# EAGLE design untitled (EAGLE 9.6.2)
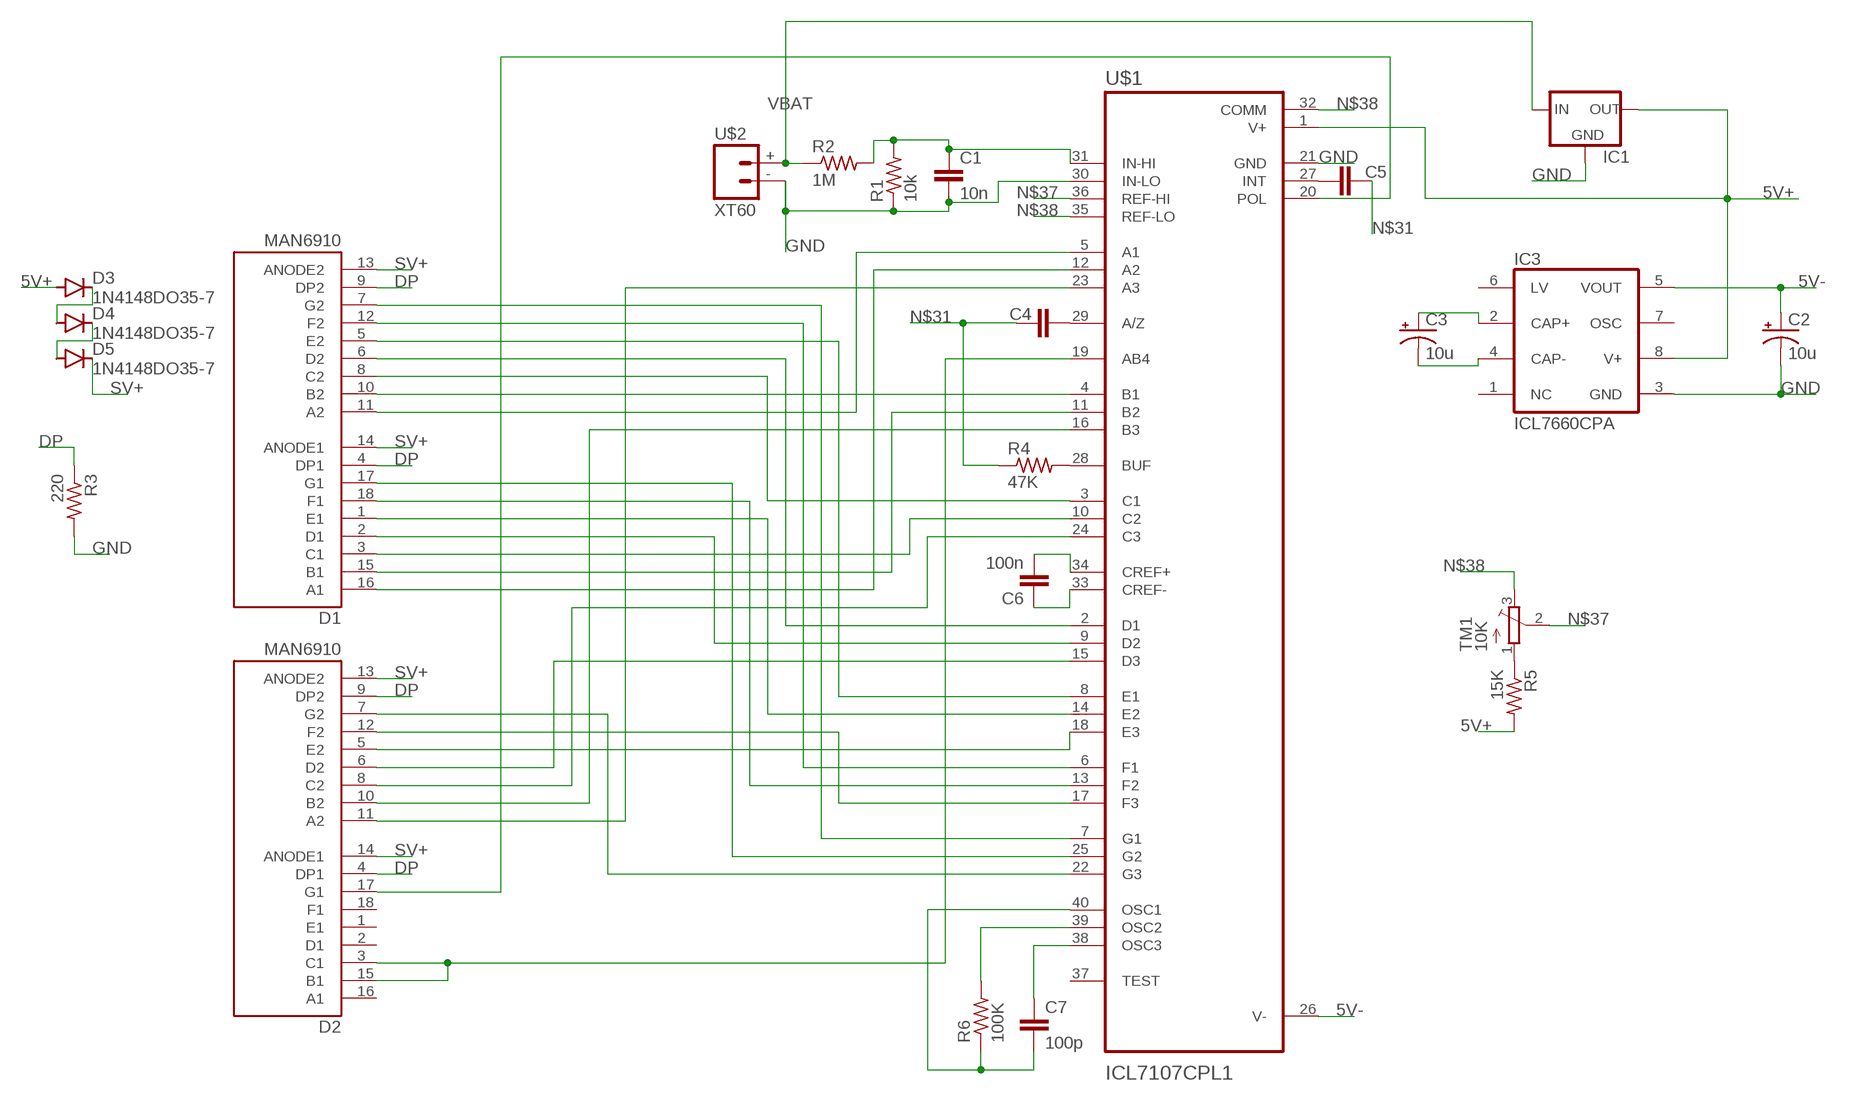
[diagram p0: schematic, sheet 1]

## Parts
C1  10n  CAPKIT  [CAP-PTH-SMALL-KIT]
C2  10u  CAP_THTE2-5  [E2-5]
C3  10u  CAP_THTE2-5  [E2-5]
C4  CAPKIT  [CAP-PTH-SMALL-KIT]
C5  CAPKIT  [CAP-PTH-SMALL-KIT]
C6  100n  CAPKIT  [CAP-PTH-SMALL-KIT]
C7  100p  CAPKIT  [CAP-PTH-SMALL-KIT]
D1  MAN6910  [DIP1524W51P254L2503H810Q18]
D2  MAN6910  [DIP1524W51P254L2503H810Q18]
D3  1N4148DO35-7  [DO35-7]
D4  1N4148DO35-7  [DO35-7]
D5  1N4148DO35-7  [DO35-7]
IC1  REG_5V_L7805_HOR  [TO-220-H]
IC3  ICL7660CPA  [DIL08]
R1  10k  RES_AXIAL1/2W-0.5  [1/2W-0.5]
R2  1M  RES_AXIAL1/2W-0.5  [1/2W-0.5]
R3  220  RES_AXIAL1/2W-0.5  [1/2W-0.5]
R4  47K  RES_AXIAL1/2W-0.5  [1/2W-0.5]
R5  15K  RES_AXIAL1/2W-0.5  [1/2W-0.5]
R6  100K  RES_AXIAL1/2W-0.5  [1/2W-0.5]
TM1  10K  TRIMPOTTC33X  [TC33X]
U$1  ICL7107CPL1  [DIP1524W46P254L5271H508Q40]
U$2  XT60  [XT60]

## Nets
5V+: D3.A IC1.3(OUT) IC3.8(V+) R5.2 U$1.1(V+)
5V-: C2.+ IC3.5(VOUT) U$1.26(V-)
DP: D1.4(DP1) D1.9(DP2) D2.4(DP1) D2.9(DP2) R3.1
GND: C1.2 C2.- IC1.2(GND) IC3.3(GND) R1.1 R3.2 U$1.21(GND) U$1.30(IN-LO) U$2.-
N$2: C3.+ IC3.2(CAP+)
N$3: R4.2 U$1.28(BUF)
N$4: D3.C D4.A
N$5: C1.1 R1.2 R2.2 U$1.31(IN-HI)
N$6: C3.- IC3.4(CAP-)
N$7: D4.C D5.A
N$8: D1.3(C1) U$1.10(C2)
N$9: D1.6(D2) U$1.2(D1)
N$10: D1.8(C2) U$1.3(C1)
N$11: D1.10(B2) U$1.4(B1)
N$12: D1.11(A2) U$1.5(A1)
N$13: D1.5(E2) U$1.8(E1)
N$14: D1.12(F2) U$1.6(F1)
N$15: D1.7(G2) U$1.7(G1)
N$16: D1.2(D1) U$1.9(D2)
N$17: D1.15(B1) U$1.11(B2)
N$18: D1.16(A1) U$1.12(A2)
N$19: D1.1(E1) U$1.14(E2)
N$20: D1.18(F1) U$1.13(F2)
N$21: D1.17(G1) U$1.25(G2)
N$22: D2.6(D2) U$1.15(D3)
N$23: D2.10(B2) U$1.16(B3)
N$24: D2.12(F2) U$1.17(F3)
N$25: D2.5(E2) U$1.18(E3)
N$26: D2.8(C2) U$1.24(C3)
N$27: D2.11(A2) U$1.23(A3)
N$28: D2.7(G2) U$1.22(G3)
N$29: D2.3(C1) D2.15(B1) U$1.19(AB4)
N$30: D2.17(G1) U$1.20(POL)
N$31: C4.2 C5.1 R4.1
N$32: C4.1 U$1.29(A/Z)
N$33: C5.2 U$1.27(INT)
N$34: C6.2 U$1.34(CREF+)
N$35: C6.1 U$1.33(CREF-)
N$36: R5.1 TM1.1(A)
N$37: TM1.2(S) U$1.36(REF-HI)
N$38: TM1.3(E) U$1.32(COMM) U$1.35(REF-LO)
N$39: R6.2 U$1.39(OSC2)
N$40: C7.1 U$1.38(OSC3)
N$41: C7.2 R6.1 U$1.40(OSC1)
SV+: D1.13(ANODE2) D1.14(ANODE1) D2.13(ANODE2) D2.14(ANODE1) D5.C
VBAT: IC1.1(IN) R2.1 U$2.+
Unconnected: D2.1(E1) D2.2(D1) D2.16(A1) D2.18(F1) IC3.1(NC) IC3.6(LV) IC3.7(OSC) U$1.37(TEST)

## Library data of the parts
C1 C4-C7 = HyTechDevices:CAP: Capacitor Standard 0603 ceramic capacitor, and 0.1" leaded capacitor.
C2 C3 = GTOR - Passive Components:CAP_THT: POLARIZED CAPACITOR, American symbol; SPICEPREFIX: C
D1 D2 = MAN6910:MAN6910: Led 7-Seg Dual Ca Red Rhdp .56"; DESCRIPTION: Display Modules - LED Character and Numeric Red 7-Segment 2 Character Common Anode 2.5V (Max) 20mA 0.750 H x 0.985 W x 0.315 D (19.05mm x 25.02mm x 8.00mm) 18-DIP (0.600, 15.24mm); DIGI-KEY_PART_NUMBER: MAN6910-ND; MF: ON Semiconductor; MP: MAN6910; PACKAGE: None; PURCHASE-URL: https://pricing.snapeda.com/search/part/MAN6910/?ref=eda
D3-D5 = diode:1N4148: DIODE high speed (Philips)
IC1 = GTOR - Active Components:REG_5V_L7805: Voltage Regulator Switching 5v regulator Datasheet <http://power.murata.com/data/power/oki-78sr.pdf> Standard 7805 5V regulator. IGO (Input Ground Output). Spark Fun Electronics SKU : COM-00107 Datasheet <http://www.mouser.com/ds/2/308/MC7800-D-94905.pdf>
IC3 = maxim:ICL7660CPA: VOLTAGE CONVERTER; MF: INTERSIL; MPN: ICL7660CPA; OC_FARNELL: 1018170; OC_NEWARK: 06F7441
R1-R6 = GTOR - Passive Components:RES_AXIAL: RESISTOR, American symbol; SPICEPREFIX: R
TM1 = HyTechDevices:TRIMPOT: SMT trimmer potentiometer part number TC33X http://www.ladyada.net/library/eagle
U$1 = ICL7107CPL:ICL7107CPL; DESCRIPTION: ADC Single Dual Slope 0.003KSPS 3 1/2Digit LED 40-Pin PDIP; DIGI-KEY_PART_NUMBER: ICL7107CPL-ND; MF: Maxim Integrated; MP: ICL7107CPL; PACKAGE: DIP-40 Microsemi; PURCHASE-URL: https://pricing.snapeda.com/search/part/ICL7107CPL/?ref=eda
U$2 = HyTechDevices:XT60

## Board
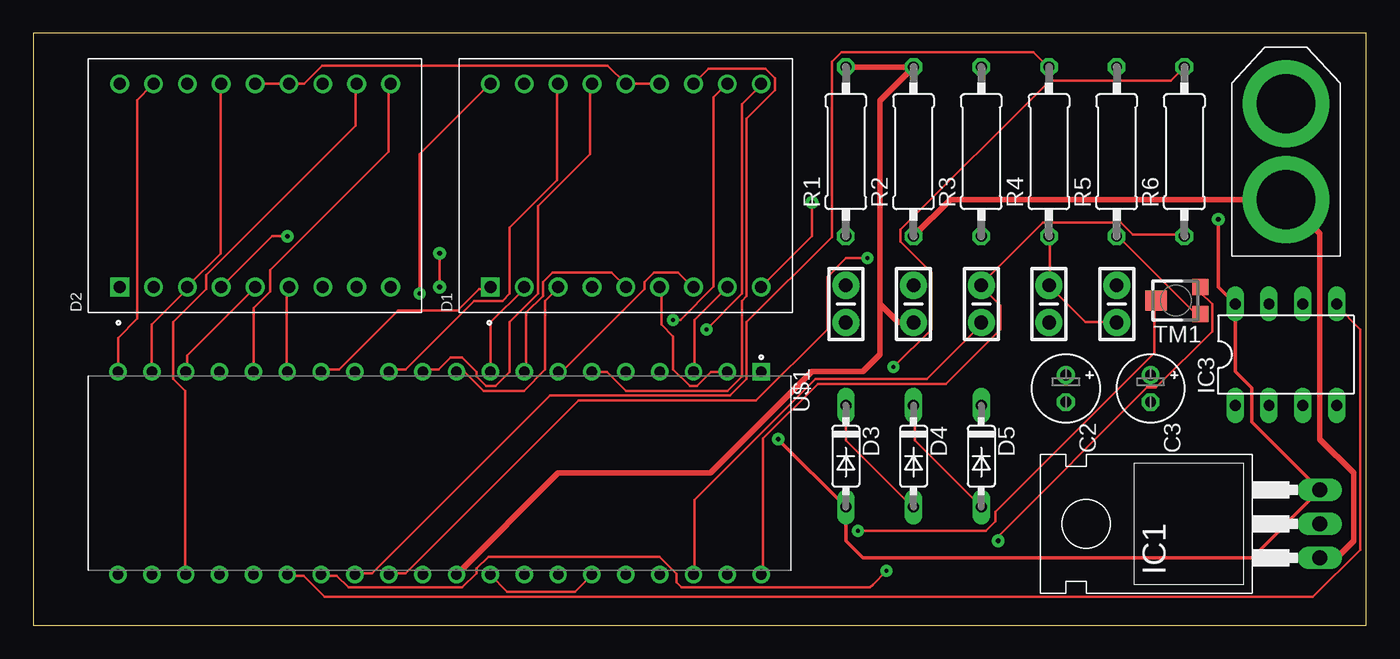
[diagram p1: board, top side]
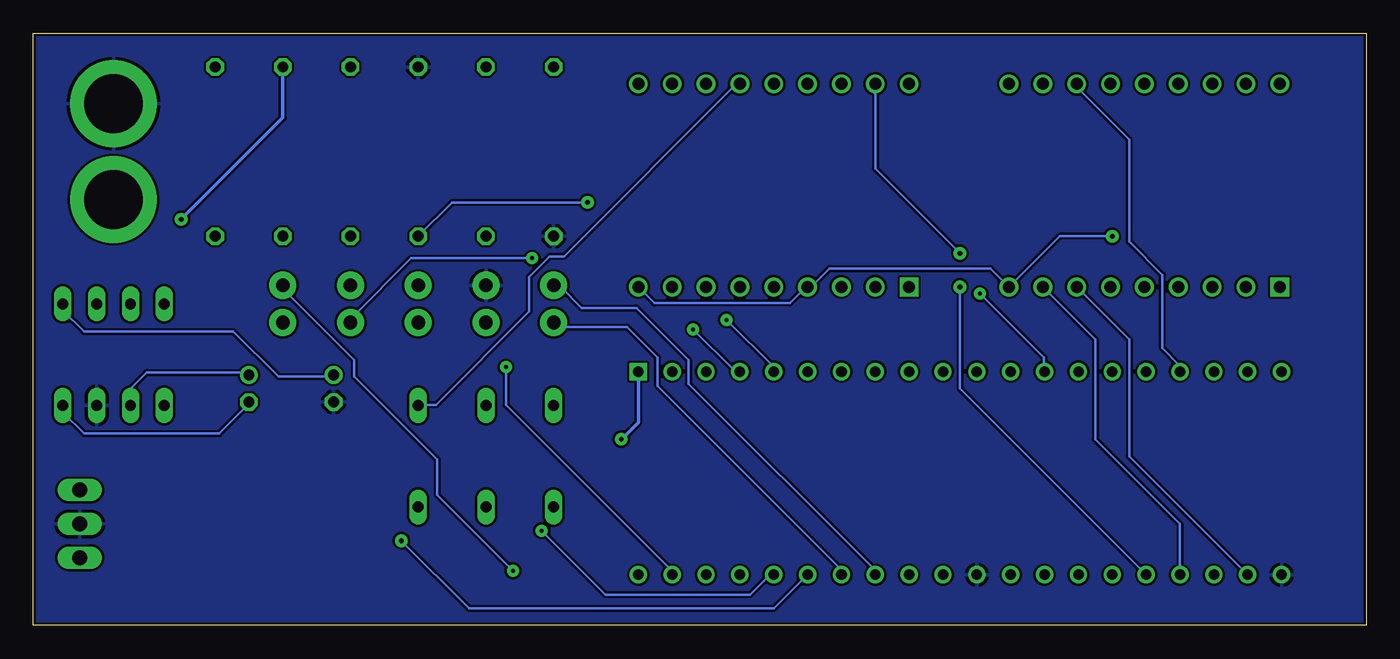
[diagram p2: board, bottom side, seen from below]

Size 100 x 44.44 mm. Coordinates in mm from the lower left corner, seen from the top.
Outline: 0,0 100,0 100,44.44 0,44.44 0,0
Copper layers (1*16): Top 0.035mm / dielectric 1.6mm / Bottom 0.035mm
Design rules "designrulecheck_jlcpcb_2layers *": minimum track width 7mil, minimum drill 0.3mm, track to track 7mil, track to pad 0.2mm, pad to pad 5mil, via to via 10mil, smd to smd 5mil, copper to edge 0.2mm, drill to drill 0.5mm, minimum pad ring 10mil, minimum via ring 0.3mm, stop-mask expansion 4mil, vias tented up to drill 0mil, thermal gap 10mil

### Footprints (pad centres in the part's own frame; a part is rotated, then mirrored left to right if it is on the bottom)
CAP-PTH-SMALL-KIT = drill 1.016 pad 2.032: 1 -1.397,0; 2 1.397,0
E2-5 = drill 0.813 pad 1.27: + -1.016,0 | drill 0.813 pad 1.27 octagon: - 1.016,0
DIP1524W51P254L2503H810Q18 = drill 0.9 square: 1 -7.62,10.16 | drill 0.9: 2 -7.62,7.62; 3 -7.62,5.08; 4 -7.62,2.54; 5 -7.62,0; 6 -7.62,-2.54; 7 -7.62,-5.08; 8 -7.62,-7.62; 9 -7.62,-10.16; 10 7.62,-10.16; 11 7.62,-7.62; 12 7.62,-5.08; 13 7.62,-2.54; 14 7.62,0; 15 7.62,2.54; 16 7.62,5.08; 17 7.62,7.62; 18 7.62,10.16
DO35-7 = drill 0.813 long: A 3.81,0; C -3.81,0
TO-220-H = drill 1.118 long: 1 -2.54,-6.35; 2 0,-6.35; 3 2.54,-6.35
DIL08 = drill 0.813 long: 1 -3.81,-3.81; 2 -1.27,-3.81; 3 1.27,-3.81; 4 3.81,-3.81; 5 3.81,3.81; 6 1.27,3.81; 7 -1.27,3.81; 8 -3.81,3.81
1/2W-0.5 = drill 0.813 octagon: 1 -6.35,0; 2 6.35,0
TC33X = smd 1.2 x 1.2: 1 -1,-1.825; 3 1,-1.825 | smd 1.5 x 1.6: 2 0,1.5
DIP1524W46P254L5271H508Q40 = drill 0.79 pad 1.14 square: 1 -7.62,24.13 | drill 0.79 pad 1.14: 2 -7.62,21.59; 3 -7.62,19.05; 4 -7.62,16.51; 5 -7.62,13.97; 6 -7.62,11.43; 7 -7.62,8.89; 8 -7.62,6.35; 9 -7.62,3.81; 10 -7.62,1.27; 11 -7.62,-1.27; 12 -7.62,-3.81; 13 -7.62,-6.35; 14 -7.62,-8.89; 15 -7.62,-11.43; 16 -7.62,-13.97; 17 -7.62,-16.51; 18 -7.62,-19.05; 19 -7.62,-21.59; 20 -7.62,-24.13; 21 7.62,-24.13; 22 7.62,-21.59; 23 7.62,-19.05; 24 7.62,-16.51; 25 7.62,-13.97; 26 7.62,-11.43; 27 7.62,-8.89; 28 7.62,-6.35; 29 7.62,-3.81; 30 7.62,-1.27; 31 7.62,1.27; 32 7.62,3.81; 33 7.62,6.35; 34 7.62,8.89; 35 7.62,11.43; 36 7.62,13.97; 37 7.62,16.51; 38 7.62,19.05; 39 7.62,21.59; 40 7.62,24.13
XT60 = drill 4.4 pad 6.5: + 0,-3.6; - 0,3.6

### Placement (x,y rotation side)
C1  66.04,24.13 90 top
C2  77.47,17.78 270 top
C3  83.82,17.78 270 top
C4  76.2,24.13 90 top
C5  81.28,24.13 90 top
C6  60.96,24.13 270 top
C7  71.12,24.13 90 top
D1  44.45,33.02 90 top
D2  16.64,33.02 90 top
D3  60.96,12.7 270 top
D4  66.04,12.7 270 top
D5  71.12,12.7 270 top
IC1  90.17,7.62 90 top
IC3  93.98,20.32 0 top
R1  60.96,35.56 90 top
R2  66.04,35.56 90 top
R3  71.12,35.56 90 top
R4  76.2,35.56 90 top
R5  81.28,35.56 90 top
R6  86.36,35.56 90 top
TM1  85.72,24.38 90 top
U$1  30.48,11.43 270 top
U$2  93.98,35.56 0 top

### Tracks (layer width: path | path; a pad name or v marks a point on that pad's centre or on a via)
5V+  (via drill 0.35)
  Top 0.254: v88.9,30.48 88.9,25.4 IC3.8 90.17,19.07 91.41,17.83 91.41,15.27 IC1.3 91.44,5.08 62.23,5.08 60.96,6.35 D3.A v55.88,13.97
  Bottom 0.254: v88.9,30.48 81.28,38.1 R5.2 | v55.88,13.97 54.61,15.24 U$1.1
5V-
  Top 0.178: U$1.26 19.2,3.73 20.27,3.73 21.87,2.13 96.01,2.13 99.57,5.69 99.57,22.22 97.79,24 IC3.5
  Bottom 0.178: IC3.5 97.79,23.65 96.19,22.05 84.99,22.05 81.61,18.67 77.52,18.67 C2.+
DP  (via drill 0.35)
  Top 0.178: D2.4 17.91,29.21 v19.05,29.21 | v58.42,31.75 58.42,29.21 D1.9
  Bottom 0.178: v19.05,29.21 22.99,29.21 D2.9 28.19,26.8 40.26,26.8 41.66,25.4 D1.4 42.04,25.4 43.24,24.19 53.4,24.19 D1.9 | v58.42,31.75 68.58,31.75 R3.1
GND
  pour Bottom: 0,44.45 100.33,44.45 100.33,0 0,0
N$2
  Bottom 0.178: C3.+ 83.82,18.85 83.97,19 91.49,19 92.71,17.78 IC3.2
N$3
  Top 0.178: U$1.28 24.18,3.91 25.43,3.91 38.76,17.25 52.27,17.25 53.52,18.49 53.52,22.76 59.92,29.16 59.92,42.32 60.63,43.03 75.03,43.03 76.1,41.96 R4.2
N$4
  Top 0.178: D3.C 60.98,16.36 60.98,13.87 65.96,8.89 D4.A
N$5
  Top 0.406: 63.5,24.13 63.5,39.37 R2.2 R1.2 | 63.5,24.13 64.9,22.73 C1.1 | U$1.31 39.37,11.43 50.8,11.43 58.42,19.05 62.23,19.05 63.5,20.32 63.5,24.13
N$6
  Bottom 0.178: IC3.4 97.79,16 96.19,14.4 86.06,14.4 83.92,16.53 83.92,16.71 C3.-
N$7
  Top 0.178: D5.A 66.14,13.87 66.14,16.36 D4.C
N$8
  Top 0.178: U$1.10 31.83,19.02 32.36,19.02 33.78,17.6 36.8,17.6 38.41,19.2 38.41,24.36 39.29,25.25 D1.3
N$9
  Top 0.178: U$1.2 51.92,19.02 50.85,19.02 49.78,17.96 49.25,17.96 48.01,19.2 48.01,21.69 47.12,22.58 47.12,25.25 D1.6
N$10
  Top 0.178: D1.8 49.61,22.94 49.61,19.2 U$1.3
N$11  (via drill 0.3)
  Top 0.178: v50.49,22.22 53.16,24.89 53.16,39.12 54.59,40.54 D1.10
  Bottom 0.178: v50.49,22.22 47.47,19.2 47.12,19.2 U$1.4
N$12  (via drill 0.3)
  Top 0.178: v48.01,22.94 48.54,22.94 51.03,25.42 51.03,39.65 51.92,40.54 D1.11
  Bottom 0.178: U$1.5 44.45,19.38 v48.01,22.94
N$13
  Top 0.178: U$1.8 36.98,19.2 36.98,23.47 38.23,24.71 38.23,25.78 38.94,26.49 43.38,26.49 44.45,25.42 D1.5
N$14
  Top 0.178: D1.12 50.67,41.78 54.94,41.78 55.65,41.07 55.65,40.18 53.52,38.05 53.52,24.71 53.16,24.36 53.16,18.67 52.09,17.6 44.45,17.6 43.03,19.02 41.96,19.02 U$1.6
N$15
  Top 0.178: U$1.7 39.47,19.2 39.83,19.2 45.87,25.25 45.87,25.78 46.58,26.49 48.36,26.49 49.43,25.42 D1.7
N$16
  Top 0.178: U$1.9 34.31,19.2 34.31,22.76 36.8,25.25 D1.2
N$17
  Top 0.178: U$1.11 29.34,19.2 30.4,19.2 31.29,20.09 32.18,20.09 33.25,19.02 33.25,18.67 33.96,17.96 34.67,17.96 35.74,19.02 35.74,22.76 37.87,24.89 37.87,31.47 41.78,35.38 41.78,40.54 D1.15
N$18
  Top 0.178: U$1.12 26.67,19.2 27.91,19.2 33.07,24.36 35.2,24.36 35.74,24.89 35.74,29.87 39.29,33.43 39.29,40.54 D1.16
N$19
  Top 0.178: U$1.14 21.69,19.2 22.94,19.2 27.38,23.65 31.83,23.65 33.43,25.25 34.14,25.25 D1.1
N$20  (via drill 0.3)
  Top 0.178: v28.98,24.89 28.98,35.38 34.14,40.54 D1.18
  Bottom 0.178: v28.98,24.89 24.18,20.09 24.18,19.2 U$1.13
N$21  (via drill 0.35)
  Top 0.178: v30.48,27.94 v30.48,25.4
  Bottom 0.178: D1.17 36.83,34.29 v30.48,27.94 | v30.48,25.4 30.48,17.78 U$1.25
N$22
  Top 0.178: U$1.15 19.02,19.2 19.02,25.25 D2.6
N$23
  Top 0.178: U$1.16 16.54,19.2 16.54,23.82 17.78,25.07 17.78,26.67 26.67,35.56 26.67,40.54 D2.10
N$24
  Bottom 0.178: U$1.17 14.05,19.2 14.05,19.56 15.29,20.8 15.29,26.31 17.78,28.8 17.78,36.45 21.87,40.54 D2.12
N$25
  Top 0.178: U$1.18 11.56,19.2 11.56,20.27 16.54,25.25 D2.5
N$26
  Bottom 0.178: D2.8 20.32,21.46 20.32,13.97 13.97,7.62 U$1.24
N$27
  Top 0.178: U$1.23 11.38,3.91 11.38,17.6 10.49,18.49 10.49,22.76 12.98,25.25 12.98,26.31 24.18,37.52 24.18,40.54 D2.11
N$28
  Bottom 0.178: D2.7 17.78,21.46 17.78,12.7 U$1.22
N$29
  Top 0.178: U$1.19 8.89,22.58 11.56,25.25 D2.3 11.56,25.42 14.05,27.91 14.05,40.54 D2.15
N$30
  Top 0.178: D2.17 8.89,40.54 7.79,39.43 7.79,23.02 6.35,21.59 U$1.20
N$31
  Top 0.178: R4.1 76.28,29.16 76.28,25.6 C4.2 76.28,25.42 78.94,22.76 81.25,22.76 C5.1
N$32  (via drill 0.3)
  Top 0.178: v62.59,27.56 60.98,27.56 59.56,26.14 59.56,22.22 54.23,16.89 40.89,16.89 27.91,3.91 26.67,3.91 U$1.29
  Bottom 0.178: v62.59,27.56 71.65,27.56 76.1,23.11 76.1,22.76 C4.1
N$33  (via drill 0.3)
  Top 0.178: v64.01,4.09 62.98,3.06 62.76,2.84 48.64,2.84 48.26,3.23 48.26,3.89 46.99,5.16 34.14,5.16 33.25,4.27 33.25,3.91 32.18,2.84 23.65,2.84 22.76,3.73 21.69,3.73 U$1.27
  Bottom 0.178: v64.01,4.09 69.7,9.78 69.7,12.45 75.92,18.67 75.92,19.91 81.43,25.42 C5.2
N$34
  Bottom 0.178: C6.2 60.63,22.4 55.47,22.4 53.16,20.09 53.16,17.96 39.47,4.27 39.47,3.91 U$1.34
N$35
  Bottom 0.178: U$1.33 36.98,3.91 36.98,4.27 50.85,18.14 50.85,19.91 54.76,23.82 58.85,23.82 60.45,25.42 60.81,25.42 C6.1
N$36
  Top 0.178: TM1.1 87.48,23.47 87.12,23.47 81.43,29.16 R5.1
N$37  (via drill 0.3)
  Top 0.178: v61.87,7.11 71.48,7.11 72.19,7.82 72.19,8.53 84.1,20.45 84.1,24.36 TM1.2
  Bottom 0.178: v61.87,7.11 57.07,2.31 46.23,2.31 44.81,3.73 44.45,3.73 U$1.36
N$38  (via drill 0.35)
  Top 0.178: U$1.32 35.56,2.54 40.64,2.54 U$1.35 | v72.39,6.35 72.39,6.68 83.56,17.85 84.21,17.85 88.44,22.07 88.44,24.1 87.55,24.99 TM1.3
  Bottom 0.178: v72.39,6.35 67.31,1.27 44.45,1.27 U$1.35
N$39  (via drill 0.3)
  Top 0.178: v64.54,19.38 67.39,22.22 67.39,26.49 65.08,28.8 65.08,29.69 76.28,40.89 85.34,40.89 R6.2
  Bottom 0.178: v64.54,19.38 64.54,16.53 52.09,4.09 52.09,3.91 U$1.39
N$40
  Top 0.178: U$1.38 49.61,3.91 49.61,9.42 58.67,18.49 67.03,18.49 71.12,22.58 C7.1
N$41
  Top 0.178: U$1.40 54.76,3.91 54.76,14.05 58.85,18.14 68.45,18.14 72.54,22.22 72.54,24 71.12,25.42 C7.2 71.12,25.6 75.74,30.23 81.61,30.23 82.5,29.34 86.23,29.34 R6.1
SV+
  Top 0.178: D2.14 D2.13 20.31,40.64 21.68,42.01 43.08,42.01 D1.14 D1.13
  Bottom 0.178: D1.13 47.24,40.64 60.2,27.69 61.27,27.69 62.79,26.16 62.79,23.57 69.8,16.56 71.02,16.56 D5.C
VBAT
  Top 0.406: R2.1 68.79,31.96 U$2.+ 96.52,29.42 96.52,13.97 99.06,11.43 99.06,6.35 97.79,5.08 IC1.1